# Altium schematic sheet powersupply.SchDoc
size A
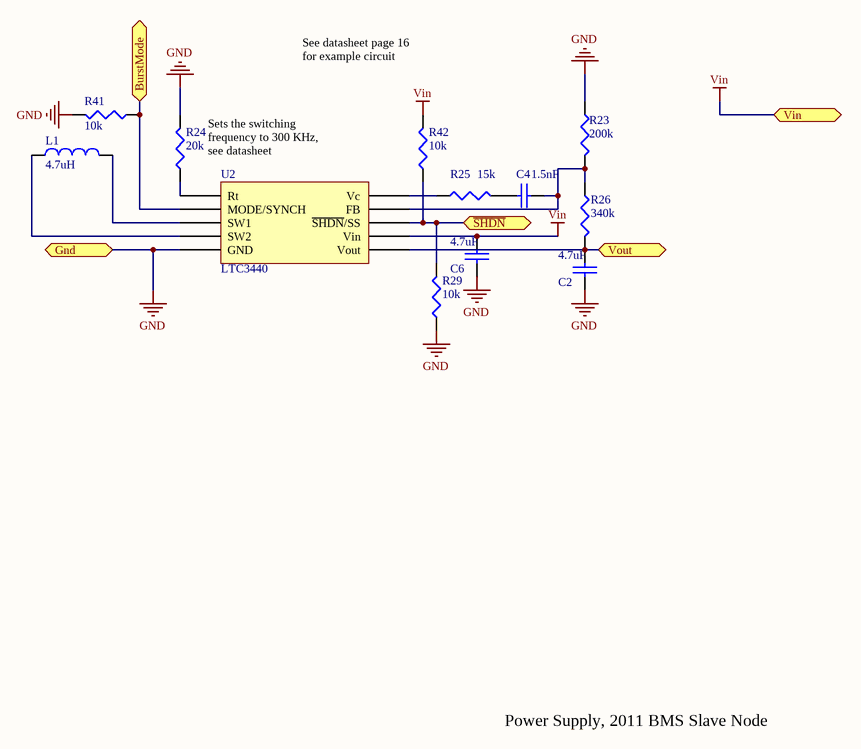
[diagram p0: powersupply.SchDoc]

## Parts
C2  4.7uF  [0805]
C4  1.5nF  [0603]
C6  4.7uF  [0805]
L1  4.7uH  [1812]
R23  200k  [0603]
R24  20k  [0603]
R25  15k  [0603]
R26  340k  [0603]
R29  10k  [0603]
R41  10k  [0603]
R42  10k  [0603]
U2  LTC3440  [MSOP10]

## Ports
BurstMode, Gnd, Vin, Vout, ~{SHDN}

## Nets
GND: C2.2 C6.2 R23.1 R24.2 R29.1 R41.2 U2.5(GND) ; port Gnd
Vin: C6.1 R42.2 U2.7(Vin) ; port Vin
BurstMode: R41.1 U2.2(MODE/SYNCH) ; port BurstMode
~{SHDN}: R29.2 R42.1 U2.8(~{SHDN}/SS) ; port ~{SHDN}
Vout: C2.1 R26.2 U2.6(Vout) ; port Vout
NetC4_1: C4.1 R25.2
NetC4_2: C4.2 R23.2 R26.1 U2.9(FB)
NetL1_1: L1.1 U2.4(SW2)
NetL1_2: L1.2 U2.3(SW1)
NetR24_1: R24.1 U2.1(Rt)
NetR25_1: R25.1 U2.10(Vc)

## Notes on the sheet
- See datasheet page 16 for example circuit
- Sets the switching frequency to 300 KHz, see datasheet
- Power Supply, 2011 BMS Slave Node

## Library data of the parts
C2 C4 C6 = CAP: Capacitor; Value: 100nF; Needed?: NO - HW LAB
L1 = Inductor: Needed?: Not Used; Revision: July-2002: Re-released for DXP Platform.; Value: 4.7uH; Farnell: 1711929; Farnell Price: 0.405
R23-R26 R29 R41 R42 = RES1: Resistor; Order#: 9330399; Price: 0.066; Supplier: Farnell